# Altium schematic sheet MedidorCO2_ver2.SchDoc
size A4; ApprovedBy: G.Zeitune; CheckedBy: G.Zeitune; DrawnBy: M.Mainenti; DocumentNumber: 1; Revision: 2.1; SheetNumber: 1; SheetTotal: 1; DrawnDate: 8/6/2021; CheckedDdate: 9/6/2021; ApprovedDate: 9/6/2021
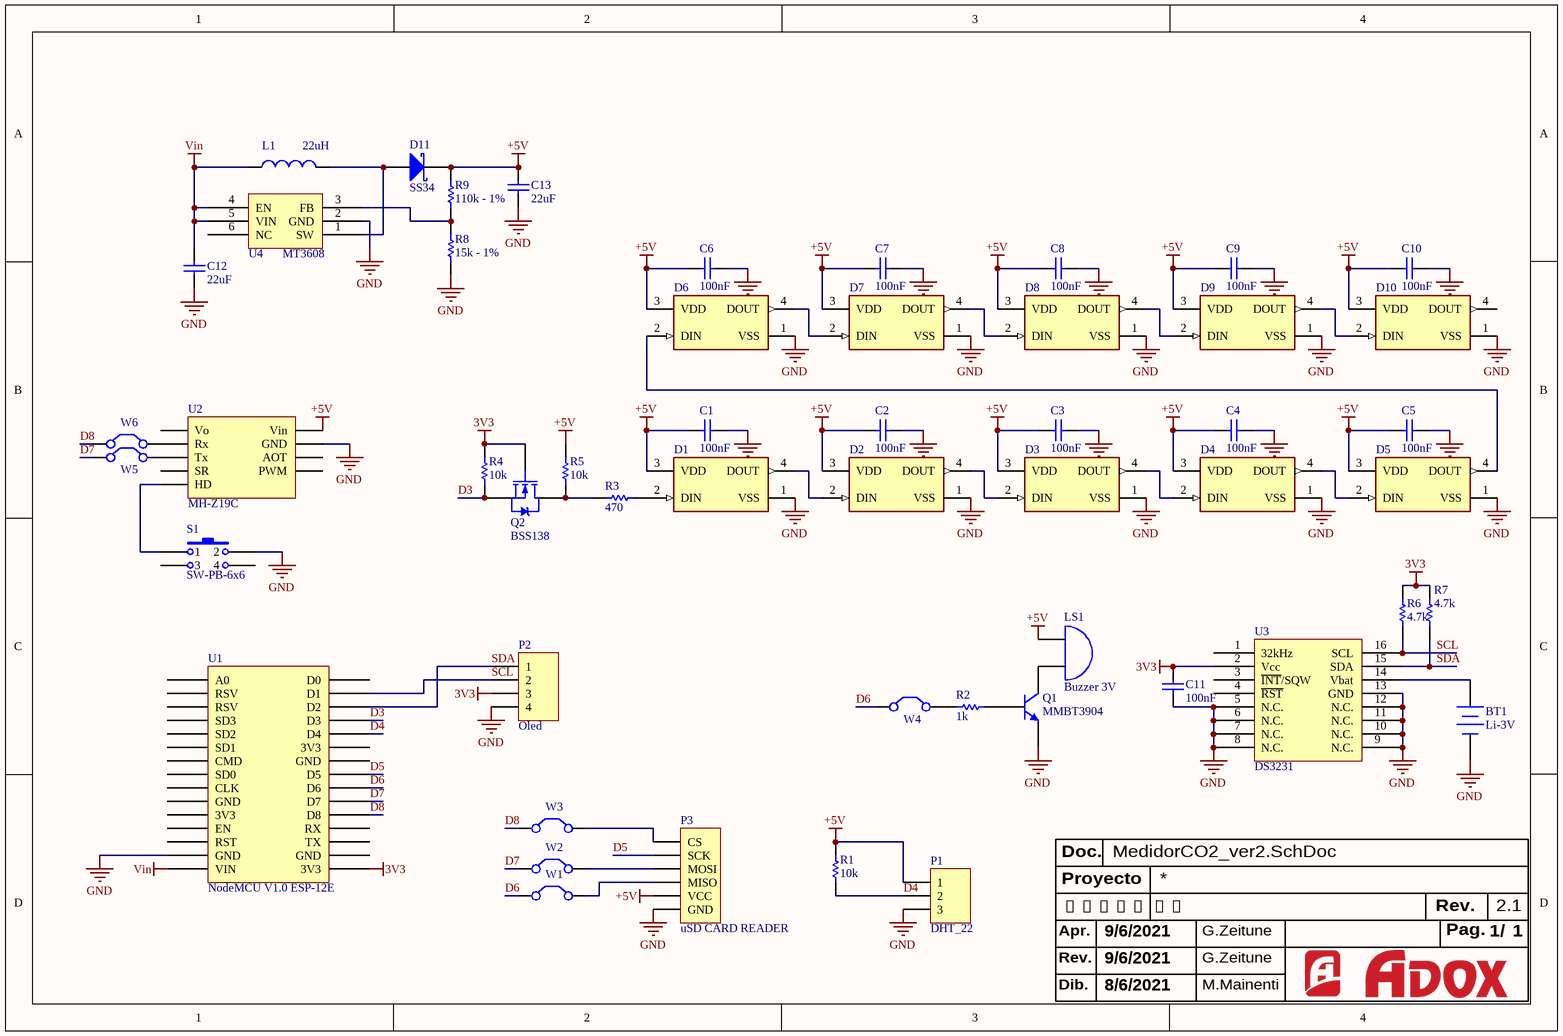
[diagram p0: MedidorCO2_ver2.SchDoc]

## Parts
BT1  Li-3V  [BAT_LI_3V]
C1  100nF  [CAPC2012N]
C2  100nF  [CAPC2012N]
C3  100nF  [CAPC2012N]
C4  100nF  [CAPC2012N]
C5  100nF  [CAPC2012N]
C6  100nF  [CAPC2012N]
C7  100nF  [CAPC2012N]
C8  100nF  [CAPC2012N]
C9  100nF  [CAPC2012N]
C10  100nF  [CAPC2012N]
C11  100nF  [CAPC2012N]
C12  22uF  [CAPC3216N]
C13  22uF  [CAPC3216N]
D1  Neopixel_5050  [Neopixel_5050]  (value not drawn)
D2  Neopixel_5050  [Neopixel_5050]  (value not drawn)
D3  Neopixel_5050  [Neopixel_5050]  (value not drawn)
D4  Neopixel_5050  [Neopixel_5050]  (value not drawn)
D5  Neopixel_5050  [Neopixel_5050]  (value not drawn)
D6  Neopixel_5050  [Neopixel_5050]  (value not drawn)
D7  Neopixel_5050  [Neopixel_5050]  (value not drawn)
D8  Neopixel_5050  [Neopixel_5050]  (value not drawn)
D9  Neopixel_5050  [Neopixel_5050]  (value not drawn)
D10  Neopixel_5050  [Neopixel_5050]  (value not drawn)
D11  SS34  [SMC]
L1  22uH  [SMRH74-220MT]
LS1  Buzzer 3V  [BUZZER]
P1  DHT_22  [CON1X3]
P2  Oled  [HDR1X4]
P3  uSD CARD READER  [HDR1X6]
Q1  MMBT3904  [SOT23_N]
Q2  BSS138  [SOT-23_N]
R1  10k  [RESC2012N]
R2  1k  [RESC2012N]
R3  470  [RESC2012N]
R4  10k  [RESC2012N]
R5  10k  [RESC2012N]
R6  4.7k  [RESC2012N]
R7  4.7k  [RESC2012N]
R8  15k - 1%  [RESC2012N]
R9  110k - 1%  [RESC2012N]
S1  SW-PB-6x6  [pulsador2]
U1  NodeMCU V1.0 ESP-12E  [NodeMCU V1.0 ESP-12E]
U2  MH-Z19C  [MH-Z19C]
U3  DS3231  [SOIC16 - DS3231]
U4  MT3608  [SOT23-6]
W1  Jumper  [RESC1608N]  (value not drawn)
W2  Jumper  [RESC1608N]  (value not drawn)
W3  Jumper  [RESC1608N]  (value not drawn)
W4  Jumper  [RESC1608N]  (value not drawn)
W5  Jumper  [RESC1608N]  (value not drawn)
W6  Jumper  [RESC1608N]  (value not drawn)

## Nets
3V3: C11.1 P2.3 Q2.1(G) R4.2 R6.2 R7.2 U1.3V3 U3.2(Vcc)
+5V: C1.1 C2.1 C3.1 C4.1 C5.1 C6.1 C7.1 C8.1 C9.1 C10.1 C13.2 D1.3(VDD) D2.3(VDD) D3.3(VDD) D4.3(VDD) D5.3(VDD) D6.3(VDD) D7.3(VDD) D8.3(VDD) D9.3(VDD) D10.3(VDD) D11.2(K) LS1.1(A) P1.1 P3.5(VCC) R1.2 R5.2 R9.2 U2.Vin
GND: BT1.2(-) C1.2 C2.2 C3.2 C4.2 C5.2 C6.2 C7.2 C8.2 C9.2 C10.2 C11.2 C12.1 C13.1 D1.1(VSS) D2.1(VSS) D3.1(VSS) D4.1(VSS) D5.1(VSS) D6.1(VSS) D7.1(VSS) D8.1(VSS) D9.1(VSS) D10.1(VSS) P1.3 P2.4 P3.6(GND) Q1.2(E) R8.1 S1.2 U1.GND U2.GND U3.5(N.C.) U3.6(N.C.) U3.7(N.C.) U3.8(N.C.) U3.9(N.C.) U3.10(N.C.) U3.11(N.C.) U3.12(N.C.) U3.13(GND) U4.2(GND)
Vin: C12.2 L1.1 U1.VIN U4.4(EN) U4.5(VIN)
D3: Q2.2(S) R4.1 U1.D3
D4: P1.2 R1.1 U1.D4
D5: P3.2(SCK) U1.D5
D6: U1.D6 W1.1(C1) W4.1(C1)
D7: U1.D7 W2.1(C1) W5.1(C1)
D8: U1.D8 W3.1(C1) W6.1(C1)
SCL: P2.2 R6.1 U1.D1 U3.16(SCL)
SDA: P2.1 R7.1 U1.D2 U3.15(SDA)
NetBT1_1: BT1.1(+) U3.14(Vbat)
NetD1_2: D1.2(DIN) R3.2
NetD1_4: D1.4(DOUT) D2.2(DIN)
NetD2_4: D2.4(DOUT) D3.2(DIN)
NetD3_4: D3.4(DOUT) D4.2(DIN)
NetD4_4: D4.4(DOUT) D5.2(DIN)
NetD5_4: D5.4(DOUT) D6.2(DIN)
NetD6_4: D6.4(DOUT) D7.2(DIN)
NetD7_4: D7.4(DOUT) D8.2(DIN)
NetD8_4: D8.4(DOUT) D9.2(DIN)
NetD9_4: D9.4(DOUT) D10.2(DIN)
NetD11_1: D11.1(A) L1.2 U4.1(SW)
NetLS1_2: LS1.2(B) Q1.3(C)
NetP3_1: P3.1(CS) W3.2(C2)
NetP3_3: P3.3(MOSI) W2.2(C2)
NetP3_4: P3.4(MISO) W1.2(C2)
NetQ1_1: Q1.1(B) R2.2
NetQ2_3: Q2.3(D) R3.1 R5.1
NetR2_1: R2.1 W4.2(C2)
NetR8_2: R8.2 R9.1 U4.3(FB)
NetS1_1: S1.1 U2.HD
NetU2_Rx: U2.Rx W6.2(C2)
NetU2_Tx: U2.Tx W5.2(C2)

Not connected (* = marked no-connect by the designer): D10 4(DOUT); S1 3 4; U1 A0 CLK CMD D0 EN RST RSV RX SD0 SD1 SD2 SD3 TX; U2 AOT PWM SR Vo; U3 1(32kHz) 3(~{INT}/SQW) 4(~{RST}); U4 6(NC)

## Notes on the sheet
- Proyecto
- Pieza N�
- Doc.
- Rev.
- Apr.
- Dib.
- Pag.
- /

## Library data of the parts
BT1 = Battery: Multicell Battery; Published: 24-Mar-1999; LatestRevisionDate: 17-Jul-2002; LatestRevisionNote: Re-released for DXP Platform.; PackageReference: BAT-2; Publisher: Altium Limited
C1-C13 = Cap Semi: Capacitor (Semiconductor SIM Model); Value: 100pF; Published: 8-Jun-2000; LatestRevisionDate: 29-May-2009; LatestRevisionNote: IPC-7351 Footprint Added.; PackageReference: C1206; Publisher: Altium Limited; PackageDescription: Chip Capacitor
D1-D10 = Neopixel_5050: Adafruit Neopixel 5050 Addressable LED WS2812B/SK6812
D11 = D Schottky: Schottky Diode SS34; Published: 8-Jun-2000; LatestRevisionDate: 17-Jul-2002; LatestRevisionNote: Re-released for DXP Platform.; PackageReference: SMB; Publisher: Altium Limited; PackageDescription: DO-214-AA/SMB; 2 C-Bend Leads; Body 5.3 x 3.6 mm, inc. leads (LxW); Code_JEDEC: DO-214-AA
L1 = Inductor: Inductor SMRH74-220MT; Code_IEC: 1005; Value: 10mH; Published: 8-Jun-2000; LatestRevisionDate: 29-May-2009; LatestRevisionNote: IPC-7351 Footprint Added.; PackageReference: 0402-A; Publisher: Altium Limited; PackageDescription: Chip Inductor; Code_JEITA: 0402
LS1 = Bell: Electrical Bell; Published: 24-Mar-1999; LatestRevisionDate: 17-Jul-2002; LatestRevisionNote: Re-released for DXP Platform.; PackageReference: PIN2; Publisher: Altium Limited
P1 = Header 3: Header, 3-Pin; LatestRevisionDate: 17-Jul-2002; LatestRevisionNote: Re-released for DXP Platform.; Publisher: Altium Limited
P2 = Header 4: Header, 4-Pin; LatestRevisionDate: 17-Jul-2002; LatestRevisionNote: Re-released for DXP Platform.; Publisher: Altium Limited
P3 = Header 6: Header, 6-Pin; LatestRevisionDate: 17-Jul-2002; LatestRevisionNote: Re-released for DXP Platform.; Publisher: Altium Limited
Q1 = MMBT3904: NPN Switching Transistor; Published: 17-Sep-2003; LatestRevisionDate: 12-Dec-2006; LatestRevisionNote: IPC-7351 Footprint Added.; DatasheetVersion: 13-May-2002; PackageVersion: May-1999; PackageReference: SOT23; Publisher: Altium Limited; PackageDescription: 3-Pin SOT-23 Package 0.95 mm Pitch, 2.3 mm Lead Span; ComponentLink1Description: Manufacturer Link; ComponentLink1URL: http://www.semiconductors.philips.com/; ComponentLink2Description: Datasheet; ComponentLink2URL: http://www.semiconductors.philips.com/acrobat/datasheets/MMBT3904_4.pdf
Q2 = NMOS-2: N-Channel Power MOSFET; Note: Pin 2 is electrically connected to pin 4.; Published: 8-Jun-2000; LatestRevisionDate: 17-Jul-2002; LatestRevisionNote: Re-released for DXP Platform.; DatasheetVersion: PD-9.814; PackageVersion: Feb-1997; PackageReference: TO-220AB; Publisher: Altium Limited; PackageDescription: TO, Thru-Hole, Vertical, Heatsink Mounted; 3 In-Line Leads; Pitch 2.54 mm; ComponentLink1Description: Manufacturer Link; ComponentLink1URL: http://www.irf.com/
R1 R3-R9 = Res1: Resistor; Value: 1K; Published: 8-Jun-2000; LatestRevisionDate: 17-Jul-2002; LatestRevisionNote: Re-released for DXP Platform.; PackageReference: AXIAL-0.3; Publisher: Altium Limited; PackageDescription: Axial Device, Thru-Hole; 2 Leads; 0.3 in Pin Spacing
R2 = Res1: Resistor; Published: 8-Jun-2000; LatestRevisionDate: 17-Jul-2002; LatestRevisionNote: Re-released for DXP Platform.; PackageReference: AXIAL-0.3; Publisher: Altium Limited; PackageDescription: Axial Device, Thru-Hole; 2 Leads; 0.3 in Pin Spacing; Value: 1K
S1 = SW-PB-6x6: Switch; Published: 24-Mar-1999; LatestRevisionDate: 17-Jul-2002; LatestRevisionNote: Re-released for DXP Platform.; PackageReference: SPST-2; Publisher: Altium Limited; PackageDescription: Switch; 2 Leads
U1 = NodeMCU V1.0 ESP-12E: NodeMCU V1.0 ESP8266 (ESP-12E)
U2 = MH-Z19C: Sensor CO2
U3 = DS3231: Extremely Accurate I2C-Integrated  RTC/TCXO/Crystal
U4 = MT3608: Boost converter
W1-W6 = Jumper: Jumper Wire; Published: 24-Mar-1999; LatestRevisionDate: 17-Jul-2002; LatestRevisionNote: Re-released for DXP Platform.; PackageReference: RAD-0.2; Publisher: Altium Limited; PackageDescription: Radial Cap, Thru-Hole; 2 Leads; 0.2 in Pin Spacing